# EAGLE design USB Type C PD Schematic (EAGLE 9.6.2)
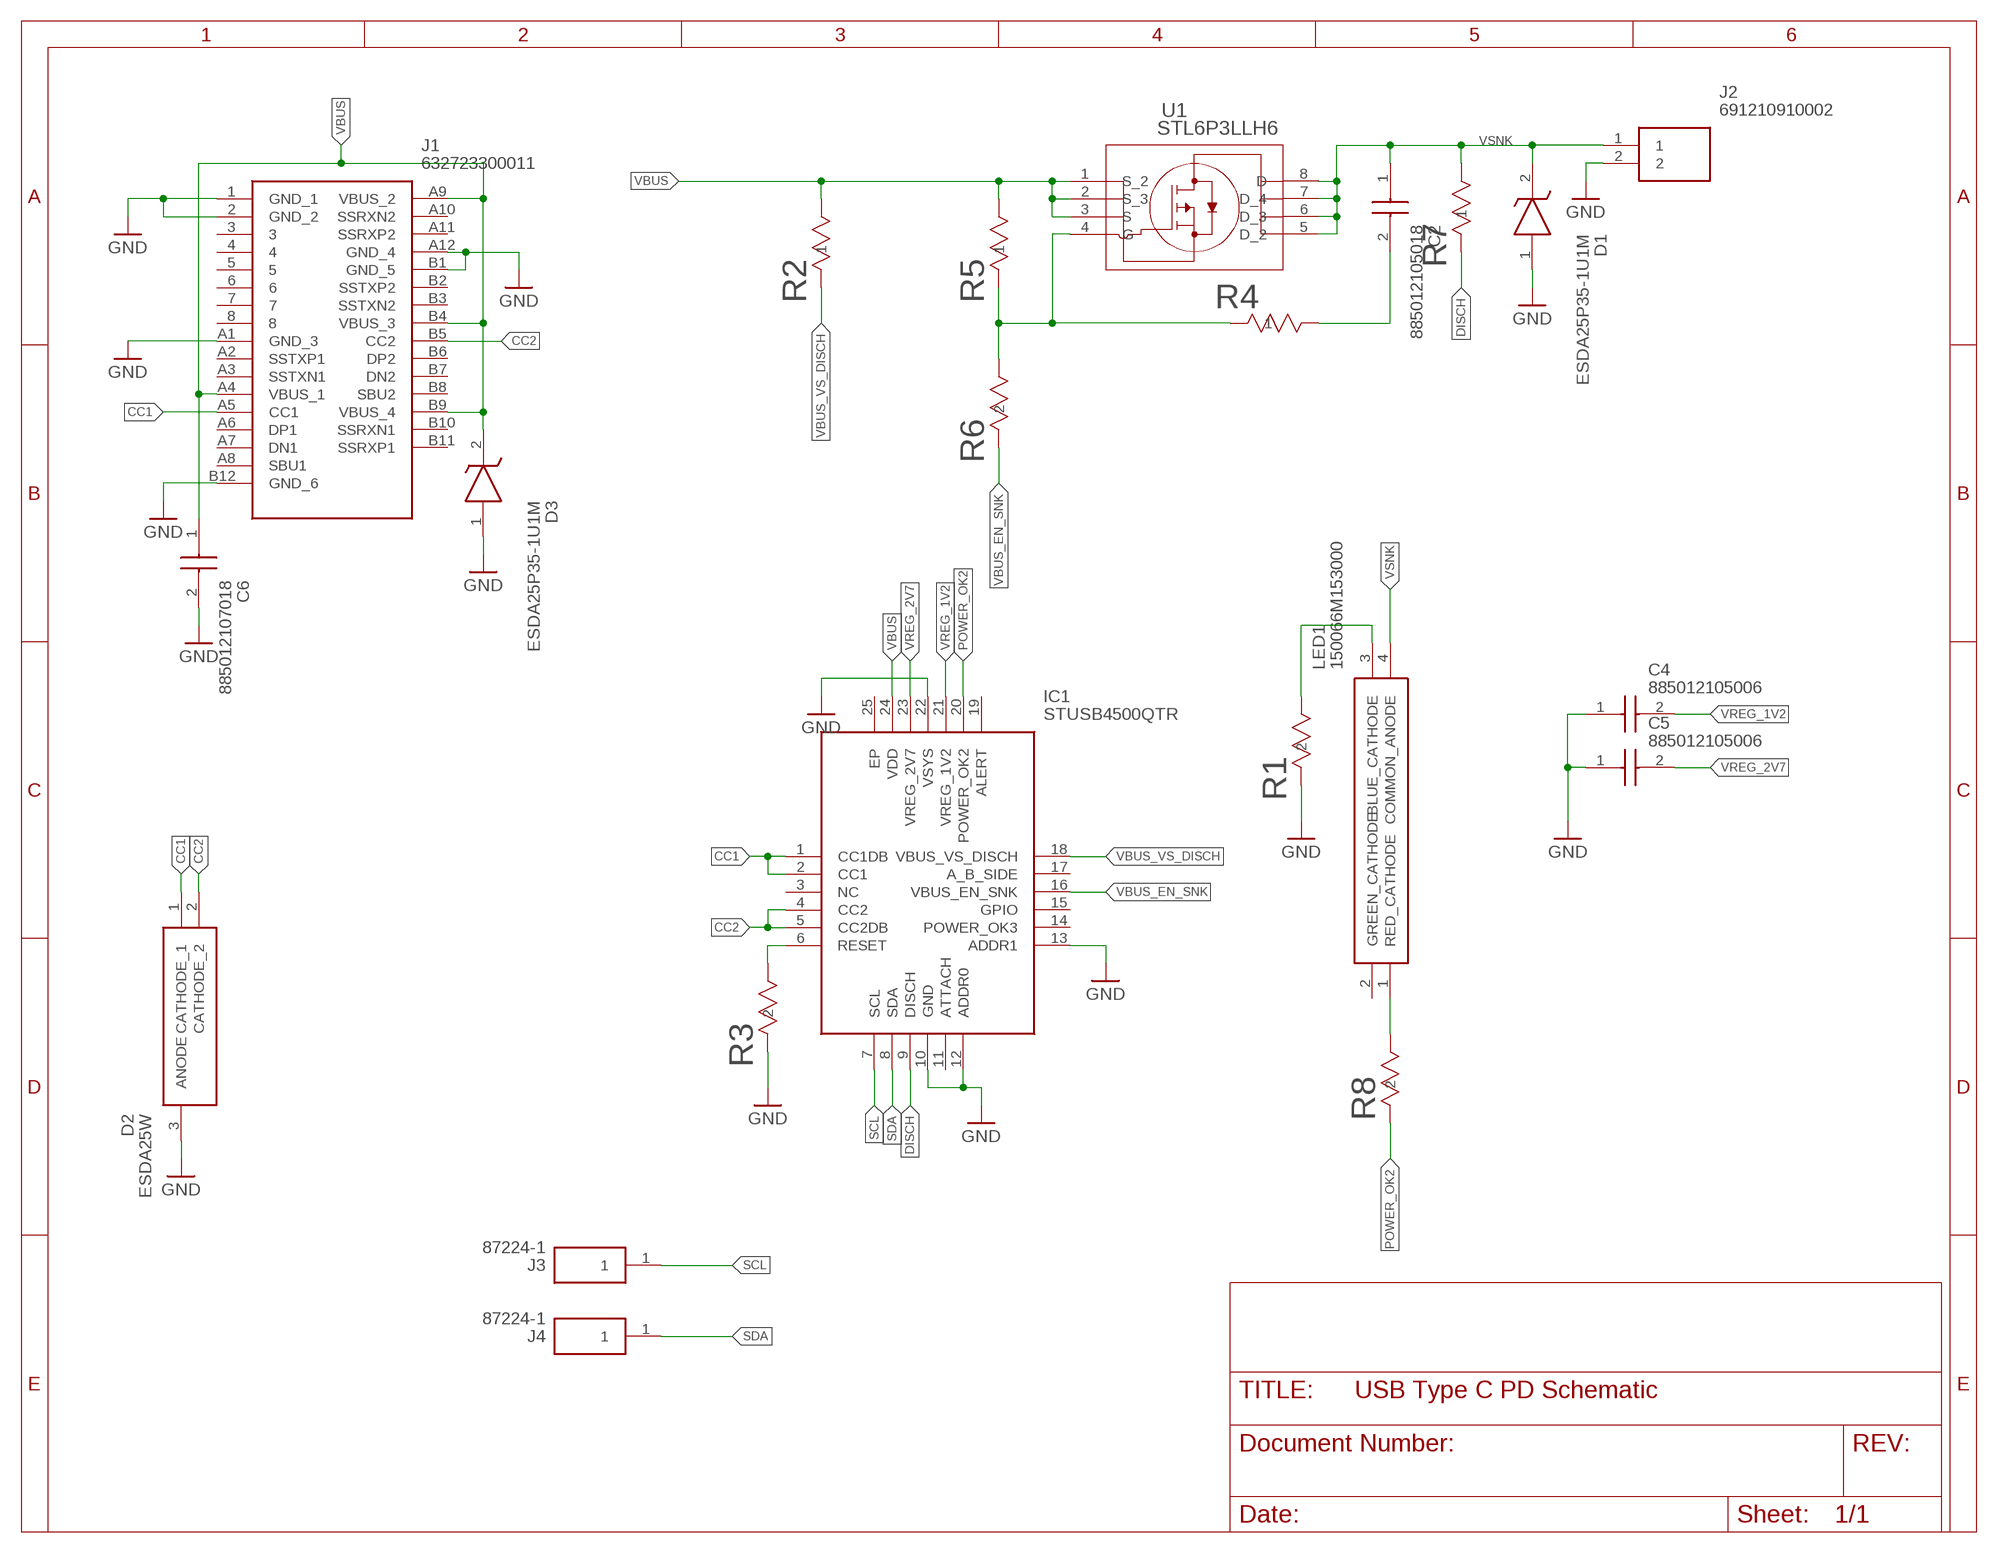
[diagram p0: schematic, sheet 1]

## Parts
C2  885012105018  [CAPC1005X55N]
C4  885012105006  [CAPC1005X55N]
C5  885012105006  [CAPC1005X55N]
C6  885012107018  [CAPC2012X145N]
D1  ESDA25P35-1U1M  [ESDA8P801U1M]
D2  ESDA25W  [SOT65P210X110-3N]
D3  ESDA25P35-1U1M  [ESDA8P801U1M]
IC1  STUSB4500QTR  [QFN50P400X400X100-25N]
J1  632723300011  [632723300011]
J2  691210910002  [691210910002]
J3  87224-1  [HDRV1W66P0X254_1X1_213X254X107]
J4  87224-1  [HDRV1W66P0X254_1X1_213X254X107]
LED1  150066M153000  [150066M153000]
R1  RC0402JR-0722KL  [RC0402N_YAG]
R2  RNCP0603FTD1K00  [STA_RNCP0603_STP]
R3  RC0402JR-0710KL  [RC0402N_YAG]
R4  RC0201FR-07100RL  [YAG_R0201_YAG]
R5  RC0603FR-07100KL  [RC0603N_YAG]
R6  RC0402JR-0722KL  [RC0402N_YAG]
R7  RNCP0603FTD1K00  [STA_RNCP0603_STP]
R8  RC0402JR-0722KL  [RC0402N_YAG]
U1  STL6P3LLH6  [POWERFLAT_3P3X3P3_STM]

## Nets
CC1: D2.1(CATHODE_1) IC1.1(CC1DB) IC1.2(CC1) J1.A5(CC1)
CC2: D2.2(CATHODE_2) IC1.4(CC2) IC1.5(CC2DB) J1.B5(CC2)
DISCH: IC1.9(DISCH) R7.1
GND: C4.1 C5.1 C6.2 D1.1(A) D2.3(ANODE) D3.1(A) IC1.10(GND) IC1.12(ADDR0) IC1.13(ADDR1) IC1.22(VSYS) J1.1(GND_1) J1.2(GND_2) J1.A1(GND_3) J1.A12(GND_4) J1.B1(GND_5) J1.B12(GND_6) J2.2 R1.2 R3.2
N$1: LED1.3(BLUE_CATHODE) R1.1
N$2: IC1.6(RESET) R3.1
N$3: LED1.1(RED_CATHODE) R8.1
N$6: R4.1 R5.1 R6.1 U1.4(G)
N$8: C2.2 R4.2
POWER_OK2: IC1.20(POWER_OK2) R8.2
SCL: IC1.7(SCL) J3.1
SDA: IC1.8(SDA) J4.1
VBUS: C6.1 D3.2(K) IC1.24(VDD) J1.A4(VBUS_1) J1.A9(VBUS_2) J1.B4(VBUS_3) J1.B9(VBUS_4) R2.2 R5.2 U1.1(S_2) U1.2(S_3) U1.3(S)
VBUS_EN_SNK: IC1.16(VBUS_EN_SNK) R6.2
VBUS_VS_DISCH: IC1.18(VBUS_VS_DISCH) R2.1
VREG_1V2: C4.2 IC1.21(VREG_1V2)
VREG_2V7: C5.2 IC1.23(VREG_2V7)
VSNK: C2.1 D1.2(K) J2.1 LED1.4(COMMON_ANODE) R7.2 U1.5(D_2) U1.6(D_3) U1.7(D_4) U1.8(D)
Unconnected: IC1.3(NC) IC1.11(ATTACH) IC1.14(POWER_OK3) IC1.15(GPIO) IC1.17(A_B_SIDE) IC1.19(ALERT) IC1.25(EP) J1.3 J1.4 J1.5 J1.6 J1.7 J1.8 J1.A2(SSTXP1) J1.A3(SSTXN1) J1.A6(DP1) J1.A7(DN1) J1.A8(SBU1) J1.A10(SSRXN2) J1.A11(SSRXP2) J1.B2(SSTXP2) J1.B3(SSTXN2) J1.B6(DP2) J1.B7(DN2) J1.B8(SBU2) J1.B10(SSRXN1) J1.B11(SSRXP1) LED1.2(GREEN_CATHODE)

## Library data of the parts
C2 = SamacSys_Parts:885012105018: Wurth Elektronik 0402 WCAP-CSGP 100nF Ceramic Multilayer Capacitor, 25 V dc, +85C, X5R Dielectric, +/-20% Source: Datasheet <http://uk.rs-online.com/web/p/products/8391685P>; DESCRIPTION: Wurth Elektronik 0402 WCAP-CSGP 100nF Ceramic Multilayer Capacitor, 25 V dc, +85C, X5R Dielectric, +/-20%; HEIGHT: 0.55mm; MANUFACTURER_NAME: Wurth Elektronik; MANUFACTURER_PART_NUMBER: 885012105018; MOUSER_PART_NUMBER: 710-885012105018; MOUSER_PRICE-STOCK: https://www.mouser.co.uk/ProductDetail/Wurth-Elektronik/885012105018?qs=0KOYDY2FL29VGtVm8%252BrbJg%3D%3D
C4 C5 = SamacSys_Parts:885012105006: Wurth Elektronik 0402 WCAP-CSGP 1uF Ceramic Multilayer Capacitor, 6.3 V dc, +85C, X5R Dielectric, +/-20% Source: Datasheet <https://katalog.we-online.com/pbs/datasheet/885012105006.pdf>; DESCRIPTION: Wurth Elektronik 0402 WCAP-CSGP 1uF Ceramic Multilayer Capacitor, 6.3 V dc, +85C, X5R Dielectric, +/-20%; HEIGHT: 0.55mm; MANUFACTURER_NAME: Wurth Elektronik; MANUFACTURER_PART_NUMBER: 885012105006
C6 = SamacSys_Parts:885012107018: Multilayer Ceramic Chip Capacitor WCAP-CSGP Series 0805 4700000pF X5R0805475M025DFCT10000 Source: Datasheet <https://katalog.we-online.com/pbs/datasheet/885012107018.pdf>; DESCRIPTION: Multilayer Ceramic Chip Capacitor WCAP-CSGP Series 0805 4700000pF X5R0805475M025DFCT10000; HEIGHT: 1.45mm; MANUFACTURER_NAME: Wurth Elektronik; MANUFACTURER_PART_NUMBER: 885012107018; MOUSER_PART_NUMBER: 710-885012107018; MOUSER_PRICE-STOCK: https://www.mouser.co.uk/ProductDetail/Wurth-Elektronik/885012107018?qs=0KOYDY2FL29T%252BRJgtTlJUg%3D%3D
D1 D3 = SamacSys_Parts:ESDA25P35-1U1M: STMicroelectronics ESDA25P35-1U1M, Uni-Directional TVS Diode, 1400W, 2-Pin QFN Source: Datasheet <https://www.st.com/resource/en/datasheet/esda25p35-1u1m.pdf>; ARROW_PART_NUMBER: ESDA25P35-1U1M; ARROW_PRICE-STOCK: https://www.arrow.com/en/products/esda25p35-1u1m/stmicroelectronics?region=nac; DESCRIPTION: STMicroelectronics ESDA25P35-1U1M, Uni-Directional TVS Diode, 1400W, 2-Pin QFN; HEIGHT: 0mm; MANUFACTURER_NAME: STMicroelectronics; MANUFACTURER_PART_NUMBER: ESDA25P35-1U1M; MOUSER_PART_NUMBER: 511-ESDA25P35-1U1M; MOUSER_PRICE-STOCK: https://www.mouser.co.uk/ProductDetail/STMicroelectronics/ESDA25P35-1U1M?qs=aVyJF2WnouQUWqgNP85ZrA%3D%3D
D2 = SamacSys_Parts:ESDA25W: STMicroelectronics ESDA25W Dual Uni-Directional TVS Diode Array, 400W peak, 3-Pin SOT-323 Source: Datasheet <https://www.st.com/resource/en/datasheet/esdaxxxwx.pdf>; ARROW_PART_NUMBER: ESDA25W; ARROW_PRICE-STOCK: https://www.arrow.com/en/products/esda25w/stmicroelectronics?region=nac; DESCRIPTION: STMicroelectronics ESDA25W Dual Uni-Directional TVS Diode Array, 400W peak, 3-Pin SOT-323; HEIGHT: 1.1mm; MANUFACTURER_NAME: STMicroelectronics; MANUFACTURER_PART_NUMBER: ESDA25W; MOUSER_PART_NUMBER: 511-ESDA25W; MOUSER_PRICE-STOCK: https://www.mouser.co.uk/ProductDetail/STMicroelectronics/ESDA25W?qs=f9uBznyCLhbO4Du0O%2FZtlA%3D%3D
IC1 = SamacSys_Parts:STUSB4500QTR: USB Interface IC CONDITIONING & INTERFACES Source: Datasheet <https://www.st.com/resource/en/datasheet/stusb4500.pdf>; ARROW_PART_NUMBER: STUSB4500QTR; ARROW_PRICE-STOCK: https://www.arrow.com/en/products/stusb4500qtr/stmicroelectronics?region=nac; DESCRIPTION: USB Interface IC CONDITIONING & INTERFACES; HEIGHT: 1mm; MANUFACTURER_NAME: STMicroelectronics; MANUFACTURER_PART_NUMBER: STUSB4500QTR; MOUSER_PART_NUMBER: 511-STUSB4500QTR; MOUSER_PRICE-STOCK: https://www.mouser.co.uk/ProductDetail/STMicroelectronics/STUSB4500QTR?qs=wUXugUrL1qyQbYMSzG1ujg%3D%3D
J1 = SamacSys_Parts:632723300011: USB Connectors WR-COM USB3.1 Type C SuperSpeed+ Rcpt Source: Datasheet <http://katalog.we-online.de/em/datasheet/632723x00011.pdf>; DESCRIPTION: USB Connectors WR-COM USB3.1 Type C SuperSpeed+ Rcpt; HEIGHT: 2mm; MANUFACTURER_NAME: Wurth Elektronik; MANUFACTURER_PART_NUMBER: 632723300011; MOUSER_PART_NUMBER: 710-632723300011; MOUSER_PRICE-STOCK: https://www.mouser.co.uk/ProductDetail/Wurth-Elektronik/632723300011?qs=NK6InXoXhq4%252B5eM1PePLPg%3D%3D
J2 = SamacSys_Parts:691210910002: Wurth Elektronik, 2109 2.54mm Pitch, 2 Way PCB Terminal Block Source: Datasheet <https://www.we-online.de/katalog/datasheet/6912109100xx.pdf>; DESCRIPTION: Wurth Elektronik, 2109 2.54mm Pitch, 2 Way PCB Terminal Block; HEIGHT: 8.7mm; MANUFACTURER_NAME: Wurth Elektronik; MANUFACTURER_PART_NUMBER: 691210910002; MOUSER_PART_NUMBER: 710-691210910002; MOUSER_PRICE-STOCK: https://www.mouser.co.uk/ProductDetail/Wurth-Elektronik/691210910002?qs=sPbYRqrBIVlpmUgpxfjjUA%3D%3D
J3 J4 = SamacSys_Parts:87224-1: 01 MODII HDR SRST UNSHRD .100 Source: Datasheet <https://www.te.com/commerce/DocumentDelivery/DDEController?Action=srchrtrv&DocNm=87224&DocType=Customer Drawing&DocLang=English>; ARROW_PART_NUMBER: 87224-1; ARROW_PRICE-STOCK: https://www.arrow.com/en/products/87224-1/te-connectivity?region=nac; DESCRIPTION: 01 MODII HDR SRST UNSHRD .100; HEIGHT: 10.744mm; MANUFACTURER_NAME: TE Connectivity; MANUFACTURER_PART_NUMBER: 87224-1; MOUSER_PART_NUMBER: 571-872241; MOUSER_PRICE-STOCK: https://www.mouser.co.uk/ProductDetail/TE-Connectivity/87224-1?qs=uJX40y%252BSWqgHHhtbHlovpg%3D%3D
LED1 = SamacSys_Parts:150066M153000: LED 0606 RGB Diffused 180-900mcd 2-3.3V 120deg Source: Datasheet <http://katalog.we-online.de/led/datasheet/150066M153000.pdf>; DESCRIPTION: LED 0606 RGB Diffused 180-900mcd 2-3.3V 120deg; HEIGHT: 0mm; MANUFACTURER_NAME: Wurth Elektronik; MANUFACTURER_PART_NUMBER: 150066M153000; MOUSER_PART_NUMBER: 710-150066M153000; MOUSER_PRICE-STOCK: https://www.mouser.co.uk/ProductDetail/Wurth-Elektronik/150066M153000?qs=5aG0NVq1C4w6V8uSO7dUTg%3D%3D
R1 R6 R8 = RC0402JR-0722KL:RC0402JR-0722KL; COPYRIGHT: Copyright (C) 2023 Ultra Librarian. All rights reserved.; MANUFACTURER_PART_NUMBER: RC0402JR-0722KL; MFR_NAME: Yageo
R2 R7 = RNCP0603FTD1K00:RNCP0603FTD1K00; COPYRIGHT: Copyright (C) 2023 Ultra Librarian. All rights reserved.; MANUFACTURER_PART_NUMBER: RNCP0603FTD1K00; MFR_NAME: Stackpole International
R3 = RC0402JR-0710KL:RC0402JR-0710KL; COPYRIGHT: Copyright (C) 2023 Ultra Librarian. All rights reserved.; MANUFACTURER_PART_NUMBER: RC0402JR-0710KL; MFR_NAME: Yageo
R4 = RC0201FR-07100RL:RC0201FR-07100RL; COPYRIGHT: Copyright (C) 2023 Ultra Librarian. All rights reserved.; MANUFACTURER_PART_NUMBER: RC0201FR-07100RL; MFR_NAME: Yageo
R5 = RC0603FR-07100KL:RC0603FR-07100KL; COPYRIGHT: Copyright (C) 2023 Ultra Librarian. All rights reserved.; MANUFACTURER_PART_NUMBER: RC0603FR-07100KL; MFR_NAME: Yageo
U1 = STL6P3LLH6:STL6P3LLH6; COPYRIGHT: Copyright (C) 2023 Ultra Librarian. All rights reserved.; MANUFACTURER_PART_NUMBER: STL6P3LLH6; MFR_NAME: STMicroelectronics

## Board
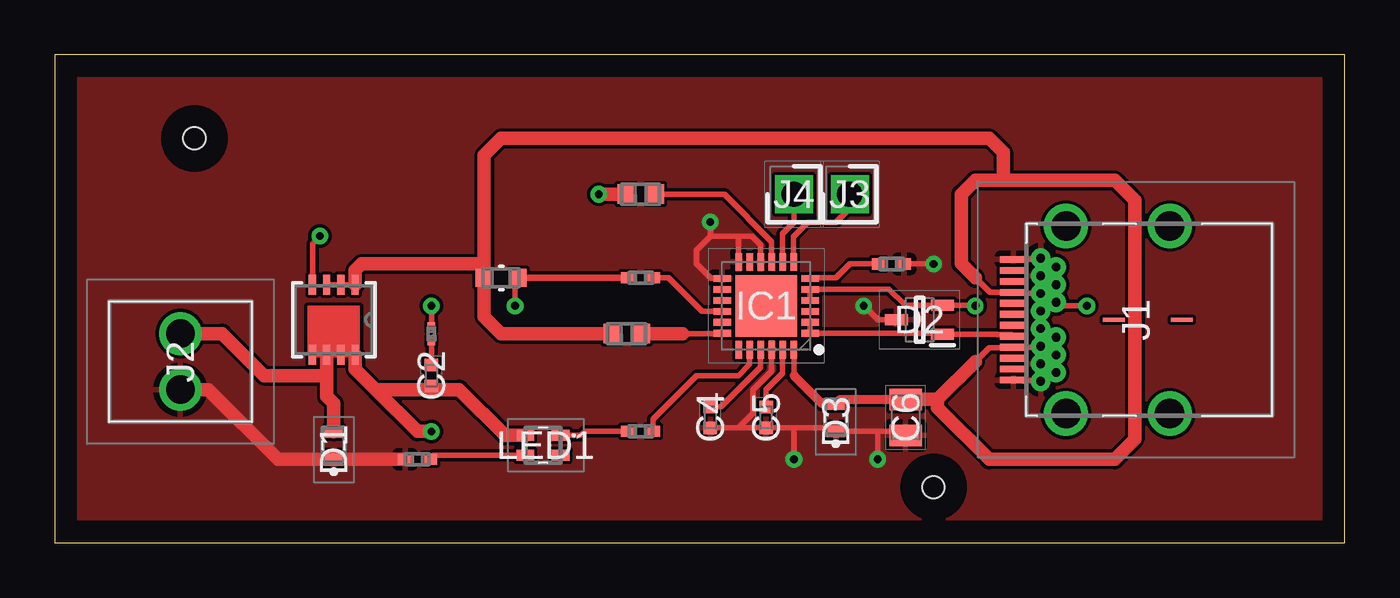
[diagram p1: board, top side]
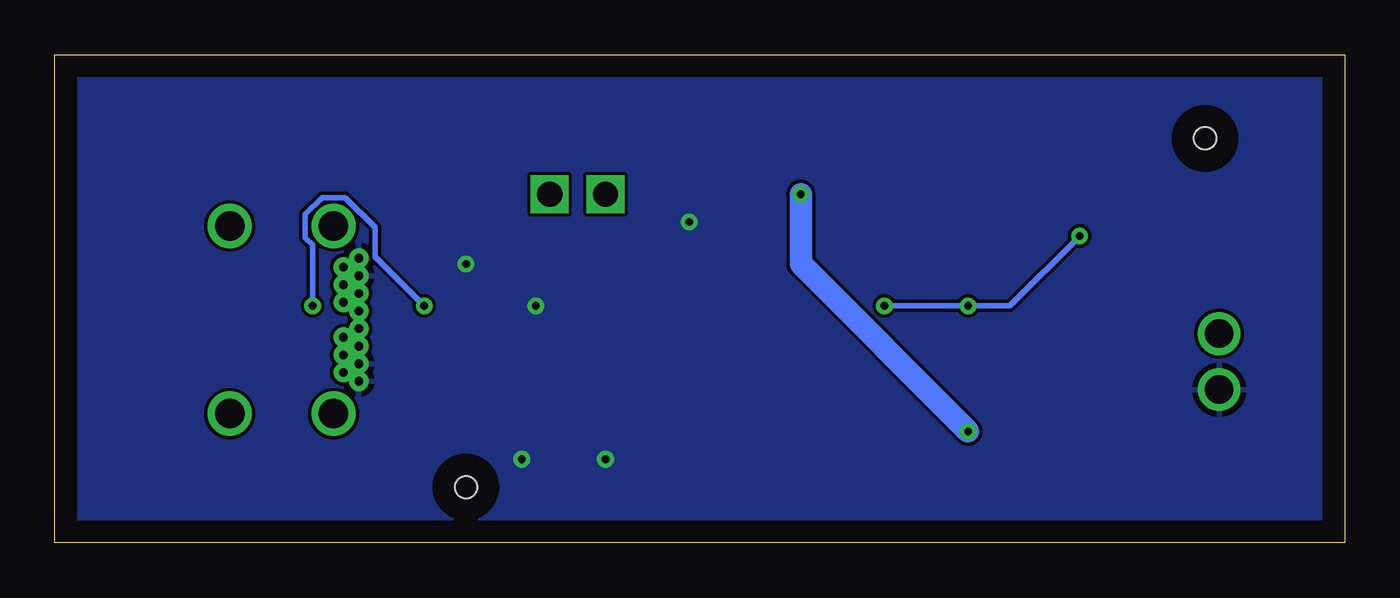
[diagram p2: board, bottom side, seen from below]

Size 58.73 x 22.21 mm. Coordinates in mm from the lower left corner, seen from the top.
Outline: 0,0 58.73,0 58.73,22.21 0,22.21 0,0
Copper layers (1*16): Top 0.035mm / dielectric 1.5mm / Bottom 0.035mm
Design rules "default": minimum track width 6mil, minimum drill 0.35mm, track to track 6mil, track to pad 6mil, pad to pad 6mil, via to via 6mil, smd to smd 6mil, copper to edge 40mil, drill to drill 6mil, minimum pad ring 10mil, minimum via ring 8mil, stop-mask expansion 4mil, vias tented up to drill 0mil, thermal gap 10mil
Holes 1 mm at 6.35,18.41 40.01,2.54

### Footprints (pad centres in the part's own frame; a part is rotated, then mirrored left to right if it is on the bottom)
CAPC1005X55N = smd 0.56 x 0.62: 1 -0.48,0; 2 0.48,0
CAPC2012X145N = smd 0.99 x 1.47: 1 -0.82,0; 2 0.82,0
ESDA8P801U1M = smd 0.55 x 0.8: 1 -0.625,0; 2 0.625,0
SOT65P210X110-3N = smd 1.05 x 0.5: 1 -1.05,0.65; 2 -1.05,-0.65; 3 1.05,0
QFN50P400X400X100-25N = smd 0.8 x 0.3: 1 -2,1.25; 2 -2,0.75; 3 -2,0.25; 4 -2,-0.25; 5 -2,-0.75; 6 -2,-1.25; 13 2,-1.25; 14 2,-0.75; 15 2,-0.25; 16 2,0.25; 17 2,0.75; 18 2,1.25 | smd 0.3 x 0.8: 7 -1.25,-2; 8 -0.75,-2; 9 -0.25,-2; 10 0.25,-2; 11 0.75,-2; 12 1.25,-2; 19 1.25,2; 20 0.75,2; 21 0.25,2; 22 -0.25,2; 23 -0.75,2; 24 -1.25,2 | smd 2.8 x 2.8: 25 0,0
632723300011 = drill 0.4 pad 0.65: 1 2,4.645; 2 -2,4.645; B1 2.8,4.645; B2 2.4,3.945; B3 1.6,3.945; B4 1.2,4.645; B5 0.8,3.945; B6 0.4,4.645; B7 -0.4,4.645; B8 -0.8,3.945; B9 -1.2,4.645; B10 -1.6,3.945; B11 -2.4,3.945; B12 -2.8,4.645 | drill 1.342 pad 2.012: 3 4.27,3.495; 4 -4.27,3.495; 5 4.27,-1.235; 6 -4.27,-1.235 | smd 0.2 x 1: 7 0,1.315; 8 0,-1.785 | smd 0.3 x 1.2: A1 -2.75,5.895; A2 -2.25,5.895; A3 -1.75,5.895; A4 -1.25,5.895; A5 -0.75,5.895; A6 -0.25,5.895; A7 0.25,5.895; A8 0.75,5.895; A9 1.25,5.895; A10 1.75,5.895; A11 2.25,5.895; A12 2.75,5.895
691210910002 = drill 1.3 pad 1.95: 1 0,0; 2 2.54,0
HDRV1W66P0X254_1X1_213X254X107 = drill 1.15 pad 1.725 square: 1 0,0
150066M153000 = smd 0.8 x 0.5: 1 -0.8,-0.45; 2 -0.8,0.45; 3 0.8,0.45; 4 0.8,-0.45
RC0402N_YAG = smd 0.66 x 0.508: 1 -0.559,0; 2 0.559,0
STA_RNCP0603_STP = smd 0.813 x 0.889: 1 -0.648,0; 2 0.648,0
YAG_R0201_YAG = smd 0.406 x 0.33: 1 -0.318,0; 2 0.318,0
RC0603N_YAG = smd 0.762 x 0.813: 1 -0.775,0; 2 0.775,0
POWERFLAT_3P3X3P3_STM = smd 0.914 x 0.33: 1 -1.6,0.975; 2 -1.6,0.325; 3 -1.6,-0.325; 4 -1.6,-0.975; 5 1.6,-0.975; 6 1.6,-0.325; 7 1.6,0.325; 8 1.6,0.975

### Placement (x,y rotation side)
C2  17.14,7.62 90 top
C4  29.84,5.71 90 top
C5  32.38,5.71 90 top
C6  38.73,5.71 270 top
D1  12.7,4.45 90 top
D2  39.37,10.16 180 top
D3  35.56,5.71 90 top
IC1  32.38,10.79 180 top
J1  49.53,10.16 90 top
J2  5.71,9.53 270 top
J3  36.2,15.88 0 top
J4  33.66,15.88 0 top
LED1  22.23,4.45 180 top
R1  16.51,3.81 180 top
R2  26.04,9.53 180 top
R3  38.1,12.7 0 top
R4  17.14,9.53 270 top
R5  20.32,12.06 180 top
R6  26.67,12.06 0 top
R7  26.67,15.88 180 top
R8  26.67,5.08 0 top
U1  12.7,10.16 270 top

### Tracks (layer width: path | path; a pad name or v marks a point on that pad's centre or on a via)
CC1
  Top 0.254: IC1.2 IC1.1 40.38,9.54 D2.1 42.89,9.51 42.92,9.48 43.56,9.48 J1.A5
CC2  (via drill 0.35)
  Top 0.254: IC1.4 IC1.5 37.98,11.54 38.72,10.81 D2.2 41.9,10.81 v41.91,10.79 | v46.99,10.79 45.75,10.79 J1.B5
  Bottom 0.254: v41.91,10.79 44.15,13.04 44.15,14.37 45.5,15.72 46.57,15.72 47.32,14.96 47.32,13.9 46.99,13.57 v46.99,10.79
DISCH
  Top 0.254: IC1.9 32.63,13.72 30.48,15.88 R7.1
GND  (via drill 0.35)
  Top 0.254: 31.11,5.24 C5.1 33.66,5.24 | 31.11,5.24 C4.1 | 31.11,5.24 31.8,5.92 31.8,6.97 32.63,7.81 IC1.22 | 33.66,5.24 35.41,5.24 D3.1 37.47,5.09 | 37.47,5.09 38.54,5.09 C6.2 | v33.66,3.81 33.66,5.24 | v37.47,3.81 37.47,5.09 | J1.A12 44.84,12.91 J1.B1 | v36.83,10.79 37.47,10.16 D2.3 | R3.2 v40.01,12.7 | IC1.10 32.13,13.59 31.75,13.97 31.11,13.97 | 31.11,13.97 29.84,13.97 | 29.84,13.97 29.21,13.34 29.21,12.7 29.86,12.04 IC1.13 | IC1.12 31.11,12.81 31.11,13.97 | 29.84,13.97 v29.84,14.61 | J1.A1 44.84,7.41 J1.B12
  Top 0.61: J2.2 6.99,6.99 10.16,3.81 D1.1 R1.2
  pour Bottom: -1.27,-0.64 -1.27,42.55 80.01,42.55 80.01,-1.27 -1.27,-1.27
  pour Top: 0,0 59.05,0 59.05,22.23 0,22.23
N$1
  Top 0.254: R1.1 17.25,4 LED1.3
N$2
  Top 0.254: IC1.6 34.41,12.06 35.56,12.06 36.2,12.7 R3.1
N$3
  Top 0.254: LED1.1 23.95,4.89 24.13,5.08 R8.1
N$6  (via drill 0.35)
  Top 0.254: R4.1 v17.14,10.79 | v20.95,10.79 20.95,11.93 R5.1 | v12.06,13.97 11.72,13.63 U1.4
  Top 0.305: R5.1 R6.1
  Bottom 0.254: v20.95,10.79 v17.14,10.79 15.24,10.79 v12.06,13.97
N$8
  Top 0.254: C2.2 R4.2
POWER_OK2
  Top 0.254: IC1.20 31.64,8.14 31.11,7.62 29.21,7.62 27.23,5.64 R8.2
SCL
  Top 0.254: IC1.7 33.63,13.95 34.29,14.61 35.56,14.61 36.2,15.24 J3.1
SDA
  Top 0.254: IC1.8 33.13,14.09 33.66,14.61 J4.1
VBUS
  Top 0.254: J1.B9 44.84,8.91 J1.A4 43.62,8.89 42.55,8.89 41.91,8.26 | J1.B4 43.69,11.36 J1.A9 42.56,11.41 41.91,12.06 | IC1.24 33.66,8.78 33.66,7.62 | U1.3 U1.2 U1.1
  Top 0.406: 33.66,7.62 34.94,6.34 D3.2 35.76,6.54 C6.1
  Top 0.61: C6.1 40.19,6.54 | 40.19,6.54 41.91,8.26 | 41.91,12.06 41.27,12.7 41.27,15.88 41.91,16.51 43.18,16.51 | 40.19,6.54 40.19,6.17 42.55,3.81 48.26,3.81 49.17,4.72 49.17,15.6 48.26,16.51 43.18,16.51 | 19.55,12.7 19.55,17.64 20.32,18.41 42.55,18.41 43.18,17.78 43.18,16.51 | 19.55,12.7 R5.2 19.55,10.3 20.32,9.53 R2.2 | U1.1 13.68,12.4 13.97,12.7 19.55,12.7
VBUS_EN_SNK
  Top 0.254: IC1.16 29.46,10.54 27.94,12.06 R6.2
VBUS_VS_DISCH
  Top 0.254: IC1.18 30.36,9.53 28.57,9.53
  Top 0.61: 28.57,9.53 R2.1
VREG_1V2
  Top 0.254: IC1.21 32.13,8.01 30.32,6.2 C4.2
VREG_2V7
  Top 0.254: IC1.23 33.13,7.74 32.38,6.99 C5.2
VSNK  (via drill 0.35)
  Top 0.254: U1.5 U1.6 U1.7 U1.8
  Top 0.61: U1.6 12.38,7.62 | 12.38,7.62 12.38,6.67 12.7,6.35 D1.2 | J2.1 7.62,9.53 9.53,7.62 12.38,7.62 | U1.8 13.68,7.92 14.61,6.99 | 14.61,6.99 16.99,6.99 C2.1 17.3,6.99 18.41,6.99 20.5,4.89 LED1.4 | R7.2 v24.77,15.88 | v17.14,5.08 16.51,5.08 14.61,6.99
  Bottom 1.016: v24.77,15.88 24.77,12.7 v17.14,5.08